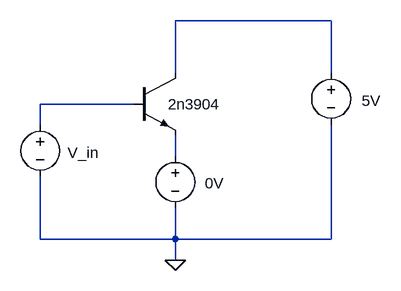
[diagram p0: schematic Experiment 1.asc]
Experiment 1.asc, the LTspice schematic file:
Version 4
SHEET 1 880 680
WIRE 400 -16 160 -16
WIRE 160 64 160 -16
WIRE 400 64 400 -16
WIRE 96 112 -48 112
WIRE -48 144 -48 112
WIRE 160 192 160 160
WIRE -48 320 -48 224
WIRE 160 320 160 272
WIRE 160 320 -48 320
WIRE 400 320 400 144
WIRE 400 320 160 320
WIRE 160 352 160 320
FLAG 160 352 0
SYMBOL npn 96 64 R0
WINDOW 0 56 32 Invisible 2
WINDOW 3 53 48 Left 2
SYMATTR InstName Q1
SYMATTR Value 2n3904
SYMBOL voltage -48 128 R0
WINDOW 0 24 16 Invisible 2
WINDOW 3 42 59 Left 2
SYMATTR InstName V1
SYMATTR Value V_in
SYMBOL voltage 160 176 R0
WINDOW 0 24 16 Invisible 2
WINDOW 3 46 58 Left 2
SYMATTR InstName V2
SYMATTR Value 0V
SYMBOL voltage 400 48 R0
WINDOW 0 24 16 Invisible 2
WINDOW 3 47 59 Left 2
SYMATTR InstName V3
SYMATTR Value 5V

The netlist it stands for:
* Experiment 1.asc
Q1 N001 N002 N003 0 2n3904
V1 N002 0 V_in
V2 N003 0 0V
V3 N001 0 5V
.model NPN NPN
.model PNP PNP
.lib standard.bjt
.backanno
.end